# EAGLE design PlantWaterer (EAGLE 7.7.0)
CNAME: Plant watering system; CREVISION: 1.1.3; DESIGNER: Maarten de Klerk
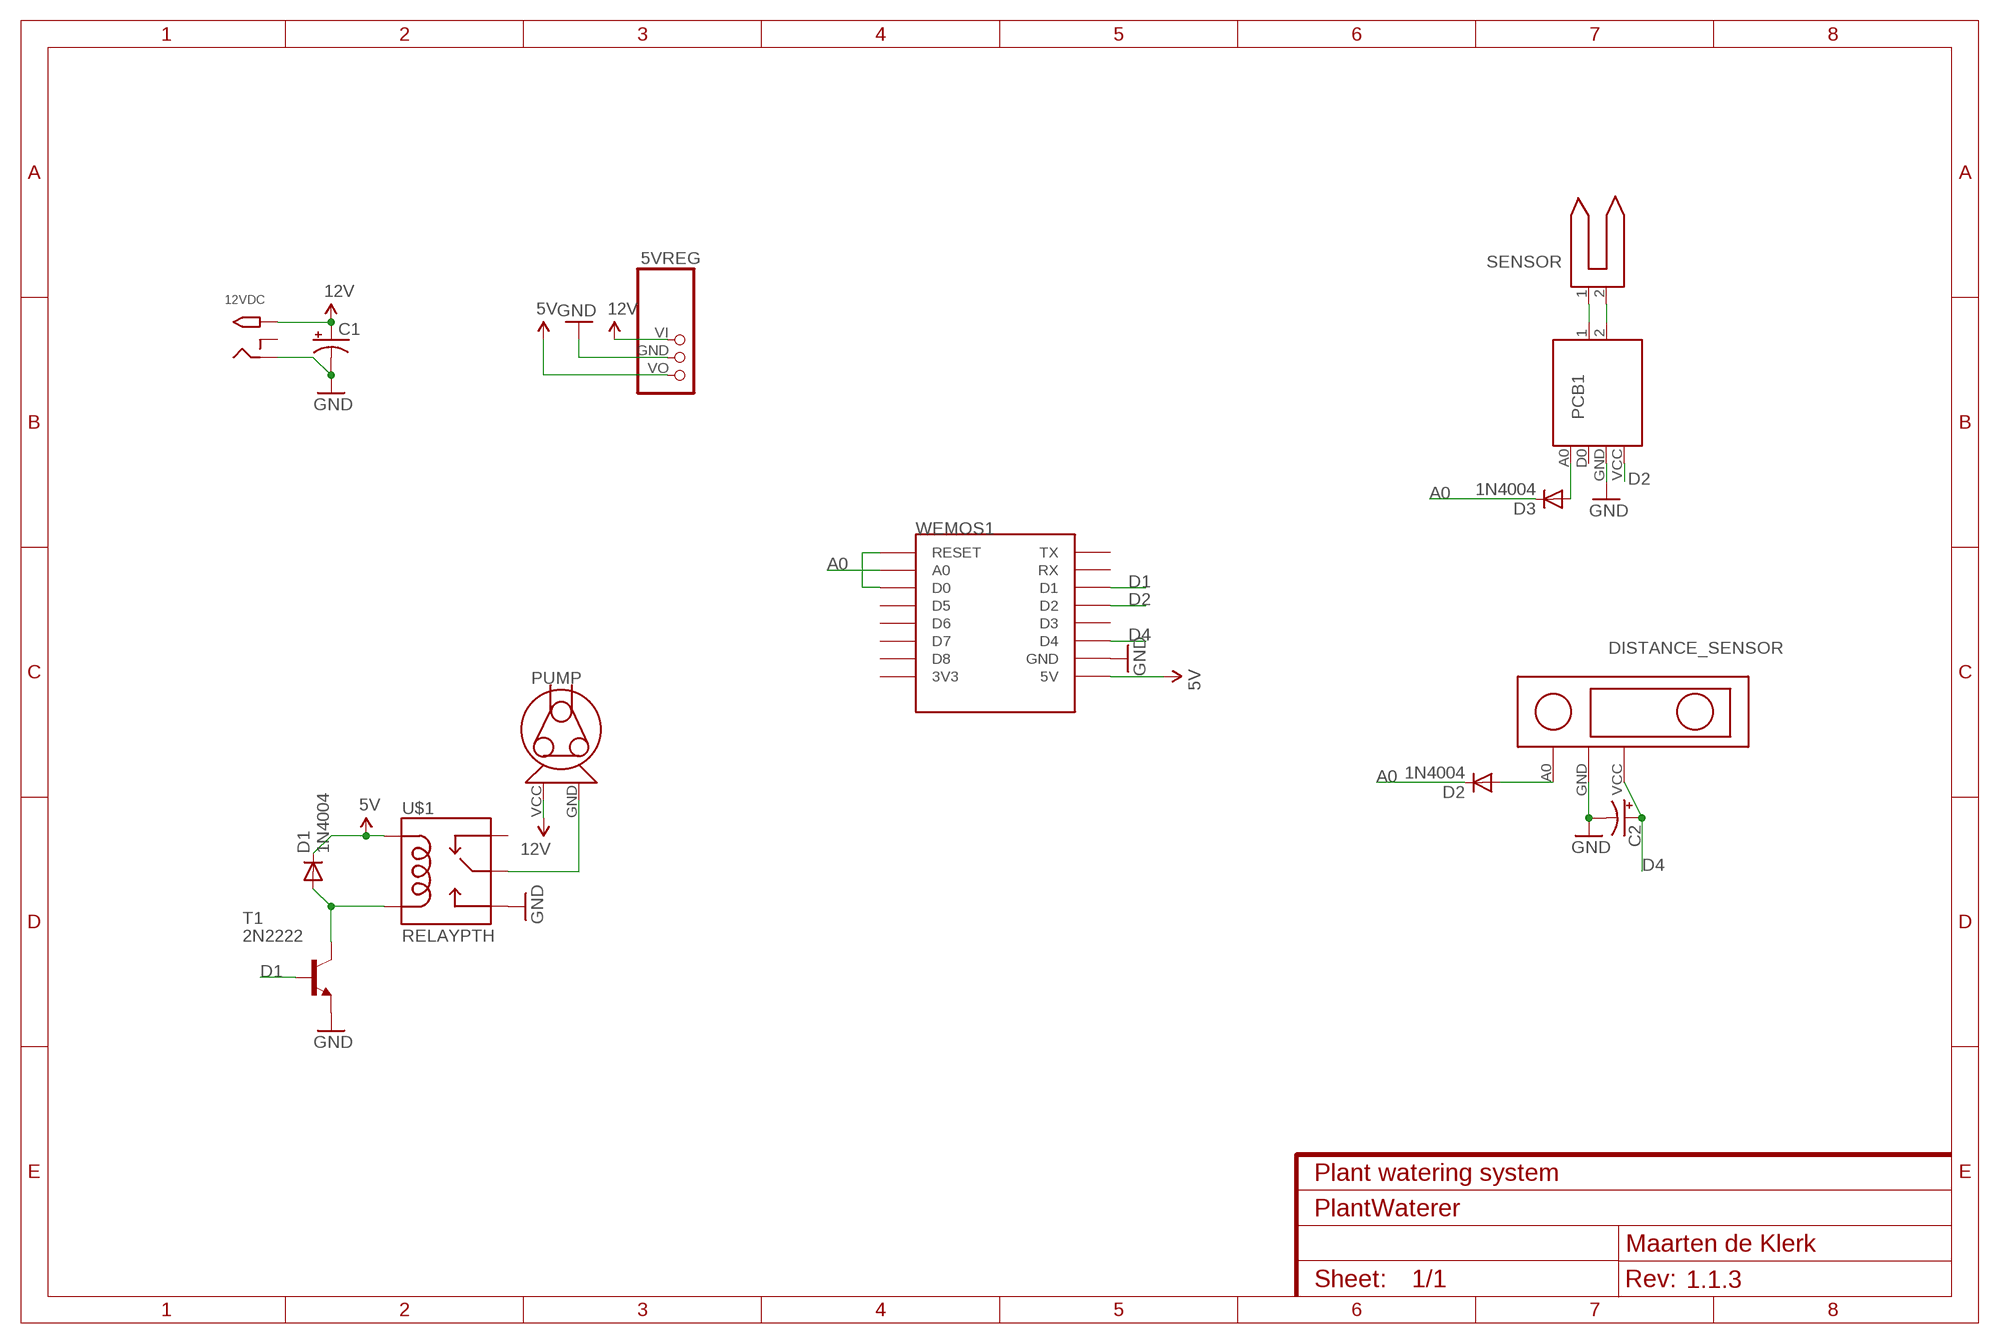
[diagram p0: schematic, sheet 1]

## Parts
5VREG  5V_REG  [5V_REG]
12VDC  2.1MMJACK  [PJ-102A]
C1  100UF-25V-20%(PTH)  [CPOL-RADIAL-100UF-25V]
C2  10UF-25V-20%(PTH)  [CPOL-RADIAL-10UF-25V]
D1  1N4004  [DO41-10]
D2  1N4004  [DO41-10]
D3  1N4004  [DO41-10]
DISTANCE_SENSOR  SHARP_GP2Y0A21YK  [SHARP_GP2Y0A21YK]
PCB1  WATER_SENSOR_PCB  [WATER_SENSOR_PCB]
PUMP  PERISTALTIC_PUMP  [PERISTALTIC_PUMP]
SENSOR  WATER_SENSOR  [WATER_SENSOR]
T1  2N2222  [TO92-EBC-OVAL]
U$1  RELAYPTH  [SRD-05VDC-SL-C]
WEMOS1  WEMOS-D1-MINI  [WEMOS-D1-MINI]

## Nets
5V: 5VREG.VO D1.C U$1.COIL1 WEMOS1.5V
12V: 5VREG.VI 12VDC.TIP C1.1(+) PUMP.VCC
A0: D2.C D3.C WEMOS1.A0
D1: T1.B WEMOS1.D1
D2: PCB1.VCC WEMOS1.D2
D4: C2.1(+) DISTANCE_SENSOR.VCC WEMOS1.D4
GND: 5VREG.GND 12VDC.RING C1.2(-) C2.2(-) DISTANCE_SENSOR.GND PCB1.GND T1.E U$1.SWOPEN WEMOS1.GND
N$1: D1.A T1.C U$1.COIL0
N$2: D2.A DISTANCE_SENSOR.A0
N$5: WEMOS1.D0 WEMOS1.RESET
N$6: PUMP.GND U$1.SWCOMMON
N$7: PCB1.1 SENSOR.1
N$9: PCB1.2 SENSOR.2
N$10: D3.A PCB1.A0
Unconnected: 12VDC.RING_SW PCB1.D0 U$1.SWCLOSED(SWCLOSE) WEMOS1.3V3 WEMOS1.D3 WEMOS1.D5 WEMOS1.D6 WEMOS1.D7 WEMOS1.D8 WEMOS1.RX WEMOS1.TX

## Library data of the parts
5VREG = maartens-lib:5V_REG: PIN HEADER
12VDC = adafruit:2.1MMJACK: 2.1mm x 5.5mm DC jack with internal switch. Digikey part #PJ-102A, 4UCON part #05537 By microbuilder.eu
C1 = SparkFun-Capacitors:100UF-25V-20%(PTH): CAP-08439; PROD_ID: CAP-08439
C2 = SparkFun-Capacitors:10UF-25V-20%(PTH): CAP-08440; PROD_ID: CAP-08440
D1-D3 = adafruit:1N4004: DIODE General purpose 1N400x type rectifier (With bigger pads) http://www.ladyada.net/library/pcb/eaglelibrary.html
DISTANCE_SENSOR = maartens-lib:SHARP_GP2Y0A21YK: Sharp GP2Y0A21YK Infrared Proximity Sensor
PCB1 = maartens-lib:WATER_SENSOR_PCB: Watering sensor pcb
PUMP = maartens-lib:PERISTALTIC_PUMP: Peristaltic pump
SENSOR = maartens-lib:WATER_SENSOR: Water sensor
T1 = adafruit:2N2222: NPN TRANSISTOR Big oval pads
U$1 = SRD-05VDC-SL-C:RELAY: SPDT relay (COM-00101)
WEMOS1 = esp8266modules:WEMOS-D1-MINI: WeMos.cc D1 mini ESP8266 module

## Board
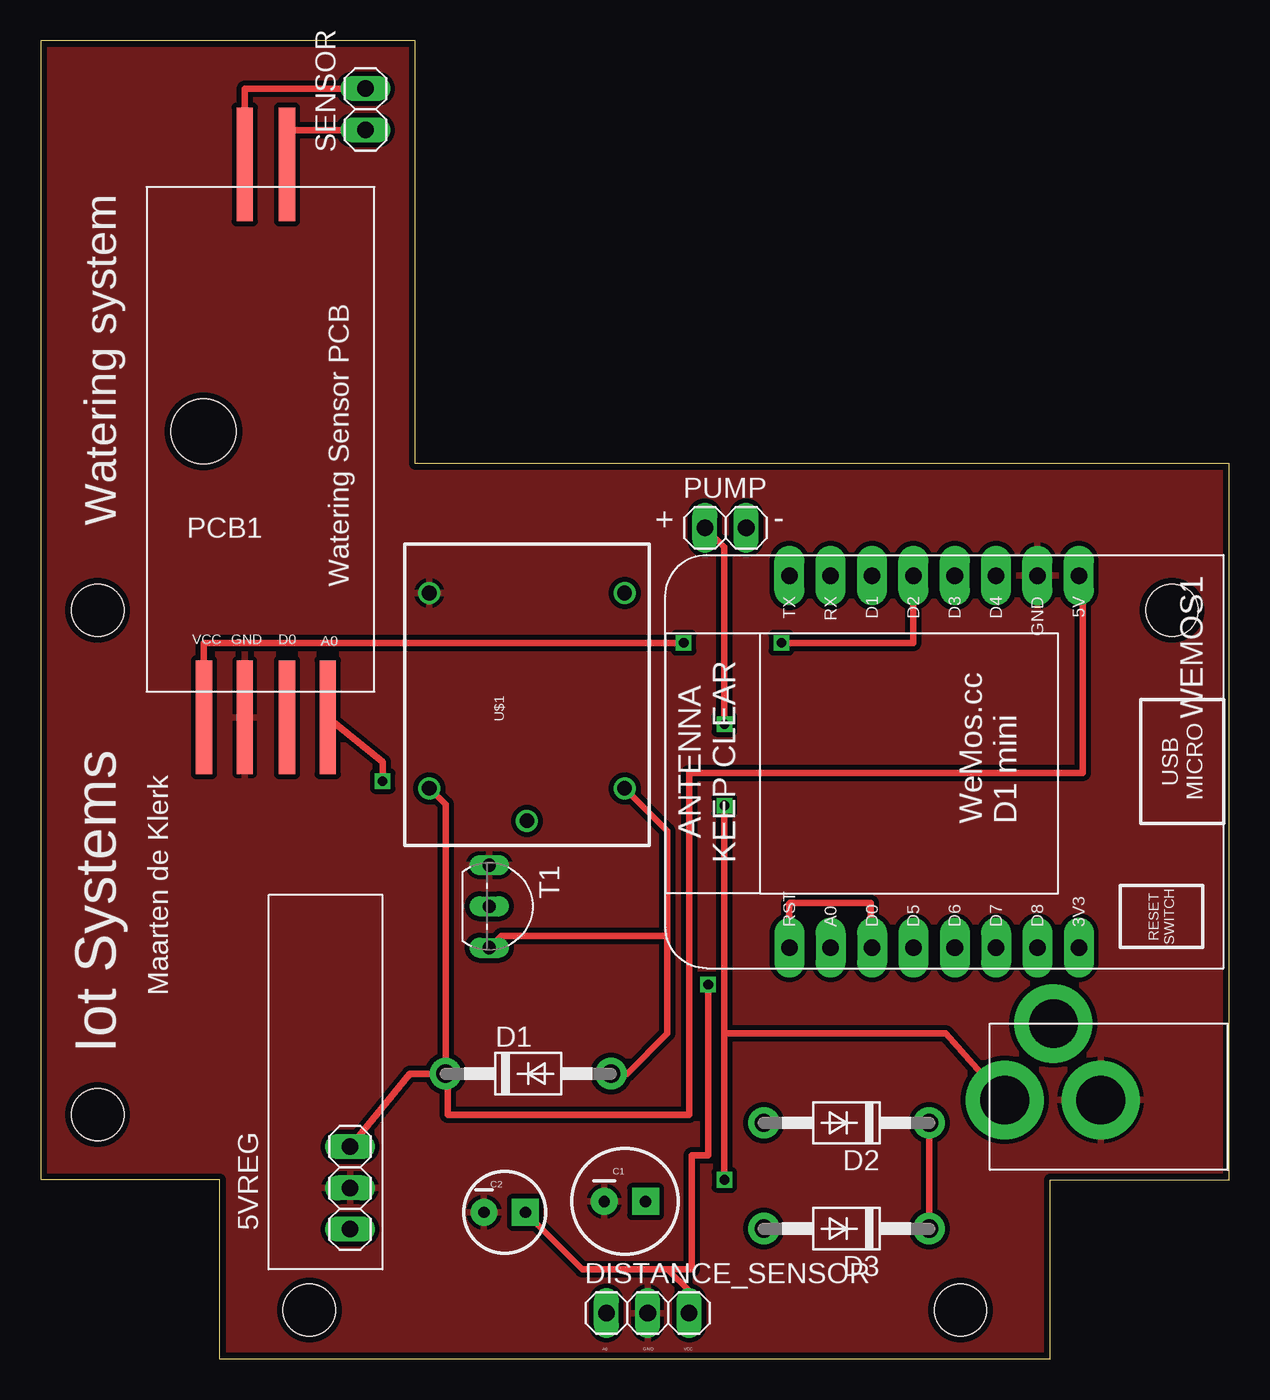
[diagram p1: board, top side]
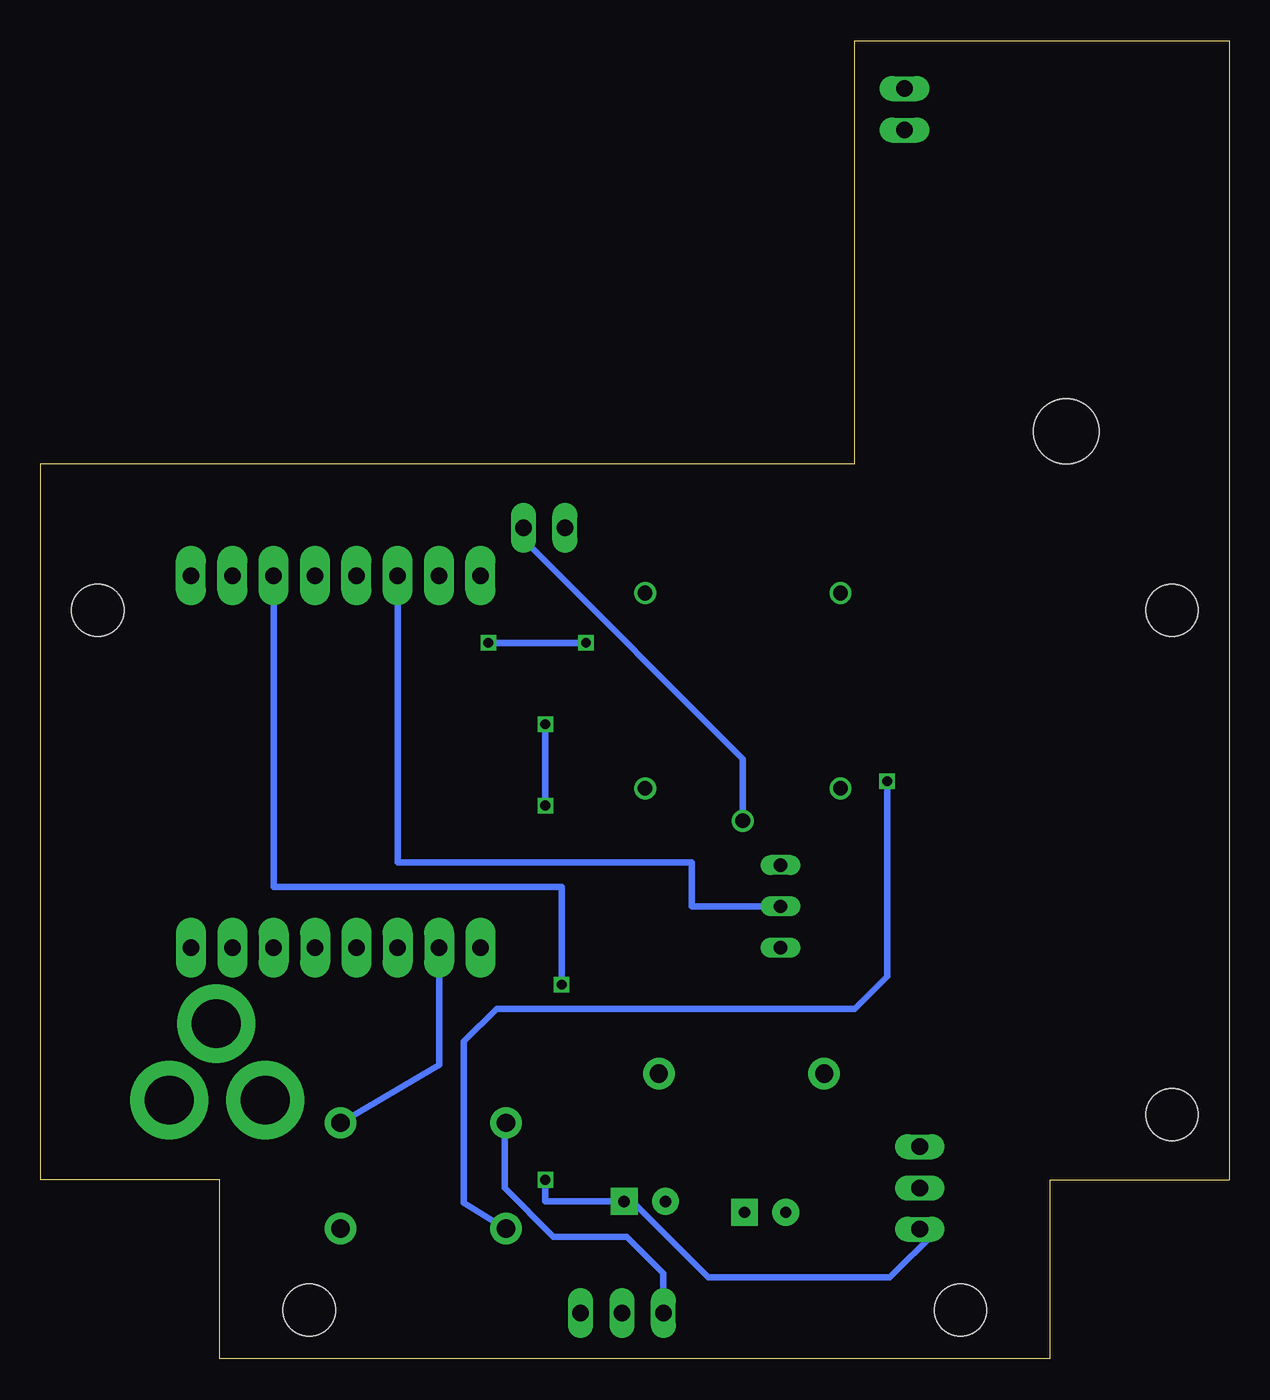
[diagram p2: board, bottom side, seen from below]

Size 73 x 81 mm. Coordinates in mm from the lower left corner, seen from the top.
Outline: 11,0 62,0 62,11 73,11 73,55 23,55 23,81 0,81 0,11 11,11 11,0
Copper layers (1*16): Top 0.0356mm / dielectric 1.5011mm / Bottom 0.0356mm
Design rules "oshpark-2layer": minimum track width 6mil, minimum drill 13mil, track to track 6mil, track to pad 6mil, pad to pad 6mil, via to via 6mil, smd to smd 6mil, copper to edge 15mil, drill to drill 6mil, minimum pad ring 7mil, minimum via ring 7mil, stop-mask expansion 2.5mil, vias tented up to drill 0mil, thermal gap 10mil
Holes 3.2 mm at 3.5,15 3.5,46 69.5,46 16.5,3 56.5,3

### Footprints (pad centres in the part's own frame; a part is rotated, then mirrored left to right if it is on the bottom)
5V_REG = drill 1.016 long: GND 0,0; VI -2.54,0; VO 2.54,0
PJ-102A = drill 3 pad 4.8: RING 0.1,-3.39; RING_SW -4.6,-6.29; TIP 0.1,-9.29
CPOL-RADIAL-100UF-25V = drill 0.7 pad 1.651 square: 1 1.27,0 | drill 0.7 pad 1.651: 2 -1.27,0
CPOL-RADIAL-10UF-25V = drill 0.7 pad 1.651 square: 1 1.27,0 | drill 0.7 pad 1.651: 2 -1.27,0
DO41-10 = drill 1.118 pad 1.93: A 5.08,0; C -5.08,0
SHARP_GP2Y0A21YK = drill 1.016 long: A0 -2.54,0; GND 0,0; VCC 2.54,0
WATER_SENSOR_PCB = smd 1 x 7: 1 8.63,32.395; 2 6.03,32.395; A0 11.13,-1.575; D0 8.63,-1.575; GND 6.03,-1.575; VCC 3.53,-1.575 | hole 4: 3.5,16
PERISTALTIC_PUMP = drill 1.016 long: GND 1.27,0; VCC -1.27,0
WATER_SENSOR = drill 1.016 long: 1 -1.27,0; 2 1.27,0
TO92-EBC-OVAL = drill 0.813 long: B 0,-1.27; C 2.54,-1.27; E -2.54,-1.27
SRD-05VDC-SL-C = drill 0.9: COIL0 -5.39,-6.12; COIL1 -5.39,5.88; SWCLOSED 6.61,-6.12; SWCOMMON -7.39,-0.12; SWOPEN 6.61,5.88
WEMOS-D1-MINI = drill 1.016 pad 1.829 long: 3V3 -10.16,-10.16; 5V 12.7,-10.16; A0 -10.16,5.08; D0 -10.16,2.54; D1 12.7,2.54; D2 12.7,0; D3 12.7,-2.54; D4 12.7,-5.08; D5 -10.16,0; D6 -10.16,-2.54; D7 -10.16,-5.08; D8 -10.16,-7.62; GND 12.7,-7.62; RESET -10.16,7.62; RX 12.7,5.08; TX 12.7,7.62

### Placement (x,y rotation side)
5VREG  19,10.5 90 top
12VDC  68.5,16 270 top
C1  35.89,9.67 0 top
C2  28.5,9 0 top
D1  29.95,17.52 0 top
D2  49.5,14.5 180 top
D3  49.5,8 180 top
DISTANCE_SENSOR  37.29,2.81 0 top
PCB1  6.5,41 0 top
PUMP  42.07,51.07 0 top
SENSOR  19.95,76.78 90 top
T1  28.82,27.8 270 top
U$1  29.75,40.45 90 top
WEMOS1  53.61,35.43 90 top

### Tracks (layer width: path | path; a pad name or v marks a point on that pad's centre or on a via)
5V
  Top 0.406: D1.C 24.87,34.06 U$1.COIL1 | D1.C 22.67,17.52 5VREG.VO | D1.C 25,17.52 25,15 39.83,15 39.83,36 64,36 64,47.63 WEMOS1.5V
12V  (via drill 0.6)
  Top 0.406: v42,11 42,20 | 42,20 v42,34 | v42,39 42,49.87 PUMP.VCC | 12VDC.TIP 55.61,20 42,20
  Bottom 0.406: v42,34 v42,39 | v42,11 42,9.67 C1.1 36.67,9.67 32,5 20.85,5 18,7.85 5VREG.VI
A0
  Top 0.406: D3.C D2.C
  Bottom 0.406: D2.C 48.53,18.05 WEMOS1.A0
D1
  Bottom 0.406: T1.B 33,27.8 33,30.5 51.07,30.5 WEMOS1.D1
D2  (via drill 0.6)
  Top 0.406: PCB1.VCC 10.03,44 v39.5,44 | v45.5,44 53.61,44 WEMOS1.D2
  Bottom 0.406: v39.5,44 v45.5,44
D4  (via drill 0.6)
  Top 0.406: DISTANCE_SENSOR.VCC 39.83,4.17 38.5,5.5 | 38.5,5.5 33.27,5.5 C2.1 | v41,23 41,12.5 40,12.5 40,5.5 38.5,5.5
  Bottom 0.406: WEMOS1.D4 58.69,29 41,29 v41,23
GND
  pour Top (isolate 0.305): 11,0 11,11 0,11 0,81 23,81 23,55 73,55 73,11 62,11 62,0
N$1
  Top 0.406: D1.A 36.02,17.52 38.5,20 38.5,26 | 38.5,26 38.5,32.43 U$1.COIL0 | T1.C 28.29,26 38.5,26
N$2
  Bottom 0.406: DISTANCE_SENSOR.A0 34.75,5.25 37,7.5 41.5,7.5 44.5,10.5 44.5,14.42 D2.A
N$5
  Top 0.406: WEMOS1.RESET 45.99,27.99 46,28 51,28 51,24.84 WEMOS1.D0
N$6
  Bottom 0.406: U$1.SWCOMMON 29.87,36.87 43,50 43,50.73 PUMP.GND
N$7
  Top 0.406: PCB1.1 15.13,75.51 SENSOR.1
N$9
  Top 0.406: PCB1.2 12.53,78.05 SENSOR.2
N$10  (via drill 0.6)
  Top 0.406: v21,35.5 21,36.69 PCB1.A0
  Bottom 0.406: D3.A 47,9.58 47,19.5 45,21.5 23,21.5 21,23.5 v21,35.5

### Text on the board
tPlace: Watering system | + | - | Maarten de Klerk | Iot Systems | A0 | GND | VCC